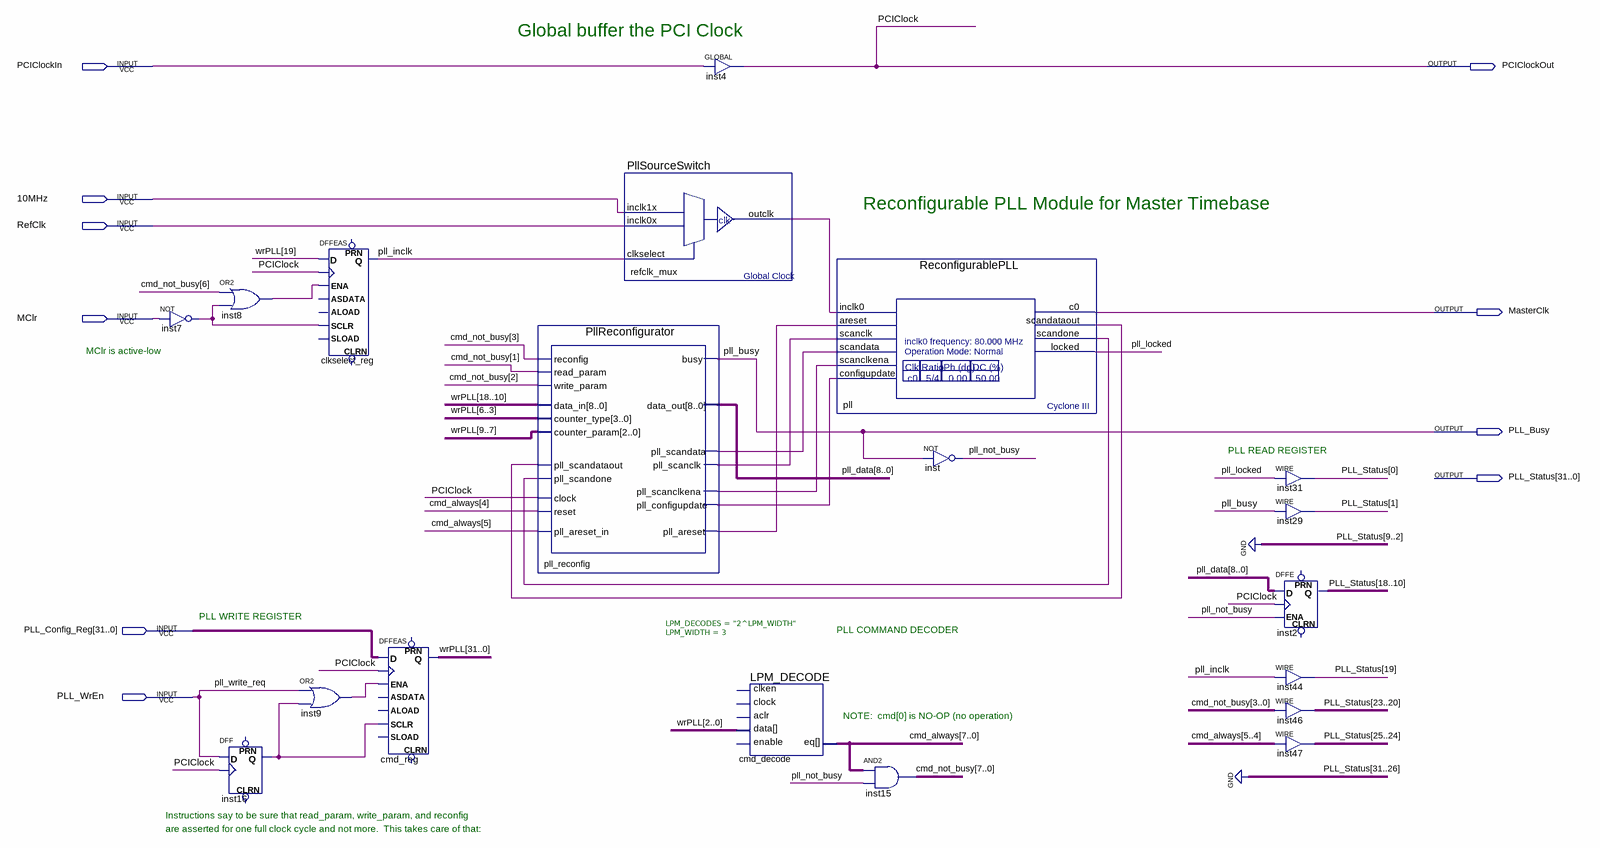
[diagram p0: schematic sheet]
// Quartus schematic Clocks.bdf as structural Verilog: 19 symbols, 10 pins
module Clocks (
  input  PCIClockIn,
  input  \10MHz ,
  input  RefClk,
  input  MClr,
  input  [31:0] PLL_Config_Reg,
  input  PLL_WrEn,
  output PCIClockOut,
  output MasterClk,
  output PLL_Busy,
  output [31:0] PLL_Status
);

  wire inst7_out, inst8_out, inst9_out, inst16_q, pll_inclk, pll_locked, pll_not_busy,
       pll_reconfig_pll_areset, pll_reconfig_pll_configupdate, pll_reconfig_pll_scanclk,
       pll_reconfig_pll_scanclkena, pll_reconfig_pll_scandata, pll_scandataout, pll_scandone,
       refclk_mux_outclk;
  wire [7:0] cmd_always, cmd_not_busy;
  wire [8:0] pll_data;
  wire [31:0] wrPLL;

  not inst7 (inst7_out, MClr);
  or inst8 (inst8_out, cmd_not_busy[6], inst7_out);
  DFF inst16 (.CLK(PCIClockOut), .D(PLL_WrEn), .Q(inst16_q));  // open: CLRN, PRN
  DFFEAS clkselect_reg (
    .ENA(inst8_out), .CLK(PCIClockOut), .D(wrPLL[19]), .SCLR(inst7_out), .Q(pll_inclk));  // open: PRN, ALOAD, ASDATA, CLRN, SLOAD
  or inst9 (inst9_out, PLL_WrEn, inst16_q);
  DFFEAS cmd_reg[31:0] (
    .ENA(inst9_out), .CLK(PCIClockOut), .D(PLL_Config_Reg), .SCLR(inst16_q), .Q(wrPLL));  // open: PRN, ALOAD, ASDATA, CLRN, SLOAD
  PllReconfigurator pll_reconfig (
    .reconfig(cmd_not_busy[3]), .read_param(cmd_not_busy[1]), .write_param(cmd_not_busy[2]),
    .data_in(wrPLL[18:10]), .counter_type(wrPLL[6:3]), .counter_param(wrPLL[9:7]),
    .pll_scandataout(pll_scandataout), .pll_scandone(pll_scandone), .clock(PCIClockOut),
    .reset(cmd_always[4]), .pll_areset_in(cmd_always[5]), .busy(PLL_Busy), .data_out(pll_data),
    .pll_scandata(pll_reconfig_pll_scandata), .pll_scanclk(pll_reconfig_pll_scanclk),
    .pll_scanclkena(pll_reconfig_pll_scanclkena), .pll_configupdate(pll_reconfig_pll_configupdate),
    .pll_areset(pll_reconfig_pll_areset));
  PllSourceSwitch refclk_mux (.clkselect(pll_inclk), .inclk1x(\10MHz ), .inclk0x(RefClk), .outclk(refclk_mux_outclk));
  GLOBAL inst4 (.IN(PCIClockIn), .OUT(PCIClockOut));
  LPM_DECODE #(.LPM_DECODES("2^LPM_WIDTH"), .LPM_WIDTH(3)) cmd_decode (
    .data(wrPLL[2:0]), .eq(cmd_always));  // open: enable, clken, clock, aclr
  ReconfigurablePLL pll (
    .inclk0(refclk_mux_outclk), .areset(pll_reconfig_pll_areset), .scanclk(pll_reconfig_pll_scanclk),
    .scandata(pll_reconfig_pll_scandata), .scanclkena(pll_reconfig_pll_scanclkena),
    .configupdate(pll_reconfig_pll_configupdate), .c0(MasterClk), .scandataout(pll_scandataout),
    .scandone(pll_scandone), .locked(pll_locked));
  assign cmd_not_busy = cmd_always & {8{pll_not_busy}};  // AND2 inst15, 8 bits wide
  not inst (pll_not_busy, PLL_Busy);
  assign PLL_Status[0] = pll_locked;  // WIRE inst31
  assign PLL_Status[1] = PLL_Busy;  // WIRE inst29
  DFFE inst2[8:0] (.D(pll_data), .CLK(PCIClockOut), .ENA(pll_not_busy), .Q(PLL_Status[18:10]));  // open: PRN, CLRN
  assign PLL_Status[19] = pll_inclk;  // WIRE inst44
  assign PLL_Status[23:20] = cmd_not_busy[3:0];  // WIRE inst46
  assign PLL_Status[25:24] = cmd_always[5:4];  // WIRE inst47

  assign {PLL_Status[31:26], PLL_Status[9:2]} = {14{1'b0}};

  // Other names for the same wires on the sheet: PCIClock = PCIClockOut; pll_write_req = PLL_WrEn

  // Notes on the sheet:
  //   Global buffer the PCI Clock
  //   Reconfigurable PLL Module for Master Timebase
  //   MClr is active-low
  //   PLL READ REGISTER
  //   PLL WRITE REGISTER
  //   PLL COMMAND DECODER
  //   NOTE:  cmd[0] is NO-OP (no operation)
  //   Instructions say to be sure that read_param, write_param, and reconfig
  //   are asserted for one full clock cycle and not more.  This takes care of that:
endmodule
